# EAGLE design modul_klawiatury_6 (EAGLE 7.7.0)
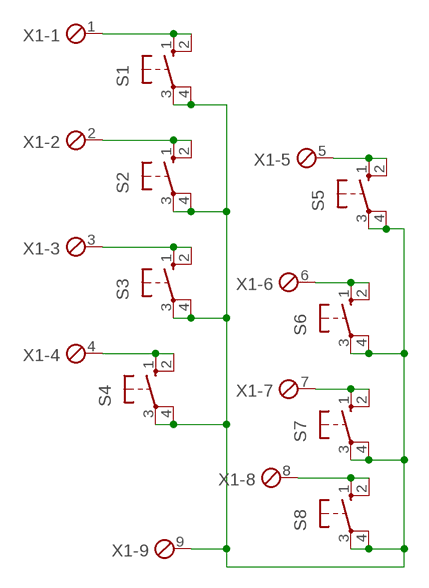
[diagram p0: schematic, sheet 1]

## Parts
S1  10-XX  [B3F-10XX]
S2  10-XX  [B3F-10XX]
S3  10-XX  [B3F-10XX]
S4  10-XX  [B3F-10XX]
S5  10-XX  [B3F-10XX]
S6  10-XX  [B3F-10XX]
S7  10-XX  [B3F-10XX]
S8  10-XX  [B3F-10XX]
X1  MPT9  [9POL254]

## Nets
N$1: S1.1(S) S1.2(S1) X1.1
N$2: S2.1(S) S2.2(S1) X1.2
N$3: S3.1(S) S3.2(S1) X1.3
N$4: S4.1(S) S4.2(S1) X1.4
N$5: S5.1(S) S5.2(S1) X1.5
N$6: S6.1(S) S6.2(S1) X1.6
N$7: S8.1(S) S8.2(S1) X1.8
N$8: S7.1(S) S7.2(S1) X1.7
N$15: S1.3(P) S1.4(P1) S2.3(P) S2.4(P1) S3.3(P) S3.4(P1) S4.3(P) S4.4(P1) S5.3(P) S5.4(P1) S6.3(P) S6.4(P1) S7.3(P) S7.4(P1) S8.3(P) S8.4(P1) X1.9

## Library data of the parts
S1-S8 = switch-omron:10-XX: OMRON SWITCH; MPN: B3F-1000; OC_FARNELL: 176432; OC_NEWARK: 36M3542
X1 = con-phoenix-254:MPT9: PHOENIX CONNECTOR; OC_FARNELL: unknown; OC_NEWARK: unknown

## Board
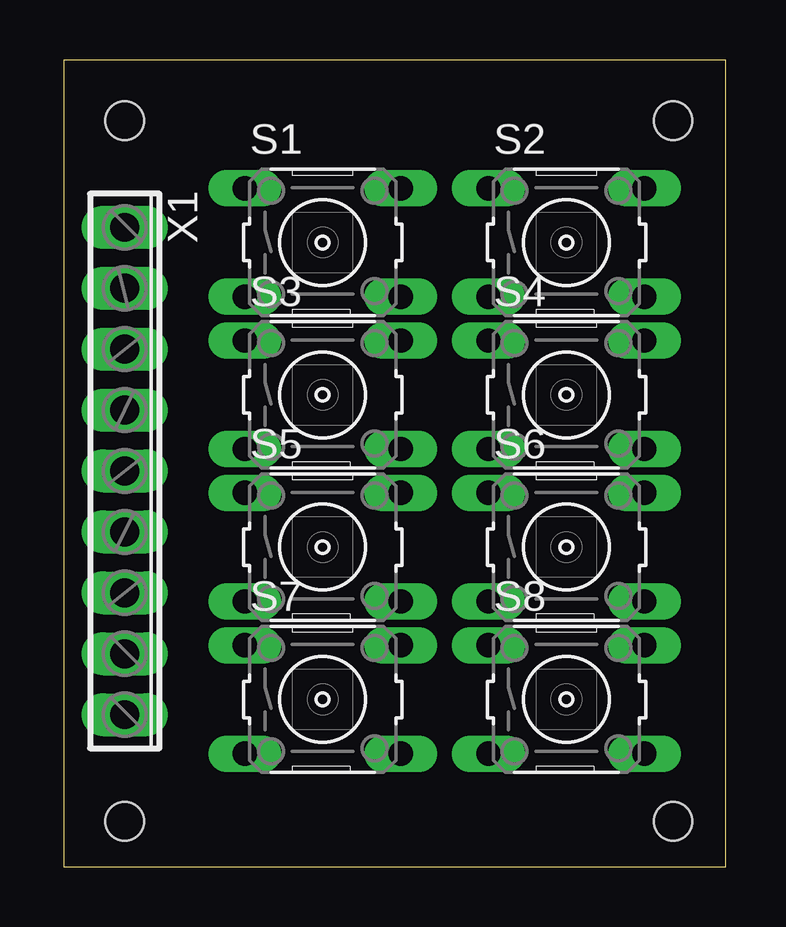
[diagram p1: board, top side]
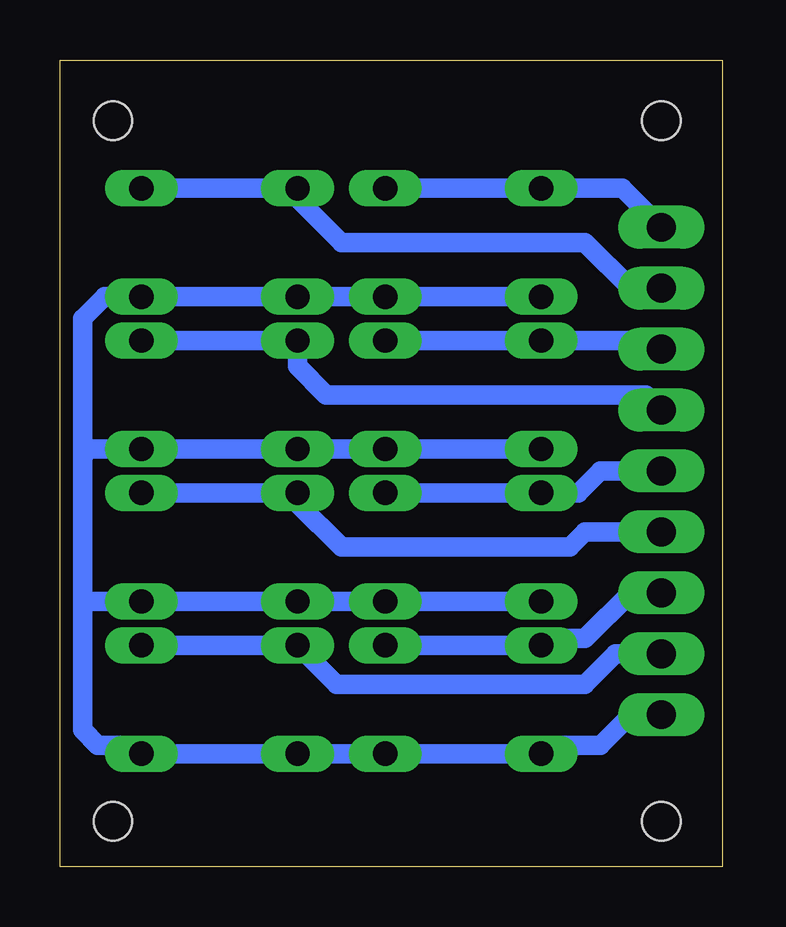
[diagram p2: board, bottom side, seen from below]

Size 27.61 x 33.65 mm. Coordinates in mm from the lower left corner, seen from the top.
Outline: 0,0 27.61,0 27.61,33.65 0,33.65 0,0
Copper layers (1*16): Top 0.035mm / dielectric 1.5mm / Bottom 0.035mm
Design rules "default": minimum track width 10mil, minimum drill 24mil, track to track 8mil, track to pad 8mil, pad to pad 8mil, via to via 8mil, smd to smd 8mil, copper to edge 40mil, drill to drill 8mil, minimum pad ring 10mil, minimum via ring 8mil, stop-mask expansion 4mil, vias tented up to drill 0mil, thermal gap 10mil
Holes 1.6 mm at 2.54,1.91 25.4,1.91 2.54,31.11 25.4,31.11

### Footprints (pad centres in the part's own frame; a part is rotated, then mirrored left to right if it is on the bottom)
B3F-10XX = drill 1.016 long: 1 -3.251,2.261; 2 3.251,2.261; 3 -3.251,-2.261; 4 3.251,-2.261
9POL254 = drill 1.2 long: 1 -10.16,0; 2 -7.62,0; 3 -5.08,0; 4 -2.54,0; 5 0,0; 6 2.54,0; 7 5.08,0; 8 7.62,0; 9 10.16,0

### Placement (x,y rotation side)
S1  10.79,26.04 0 top
S2  20.95,26.04 0 top
S3  10.79,19.68 0 top
S4  20.95,19.68 0 top
S5  10.79,13.34 0 top
S6  20.95,13.34 0 top
S7  10.79,6.99 0 top
S8  20.95,6.99 0 top
X1  2.54,16.51 270 top

### Tracks (layer width: path | path; a pad name or v marks a point on that pad's centre or on a via)
N$1
  Bottom 0.813: S1.2 S1.1 4.17,28.3 X1.1
N$2
  Bottom 0.813: X1.2 3.81,24.13 5.71,26.04 15.88,26.04 17.7,27.86 S2.1 S2.2
N$3
  Bottom 0.813: S3.2 S3.1 2.9,21.95 X1.3
N$4
  Bottom 0.813: X1.4 3.17,19.68 16.51,19.68 17.7,20.88 S4.1 S4.2
N$5
  Bottom 0.813: X1.5 5.08,16.51 5.99,15.6 S5.1 S5.2
N$6
  Bottom 0.813: X1.6 5.71,13.97 6.35,13.34 15.88,13.34 17.7,15.16 S6.1 S6.2
N$7
  Bottom 0.813: X1.8 4.45,8.89 5.71,7.62 16.08,7.62 S8.1 S8.2
N$8
  Bottom 0.813: X1.7 3.81,11.43 5.71,9.53 7.26,9.53 S7.1 S7.2
N$15
  Bottom 0.813: X1.9 3.81,6.35 5.08,5.08 7.19,5.08 S7.3 S7.4 S8.3 S8.4 24.56,5.08 26.04,5.08 26.67,5.71 26.67,10.79 | S5.3 S5.4 S6.3 S6.4 26.39,11.07 26.67,10.79 | S3.3 S3.4 S4.3 S4.4 26.39,17.42 26.67,17.14 | S1.3 S1.4 S2.3 S2.4 25.76,23.77 26.67,22.86 26.67,17.14 | 26.67,17.14 26.67,10.79